# EAGLE design LoadTag (EAGLE 5.11)
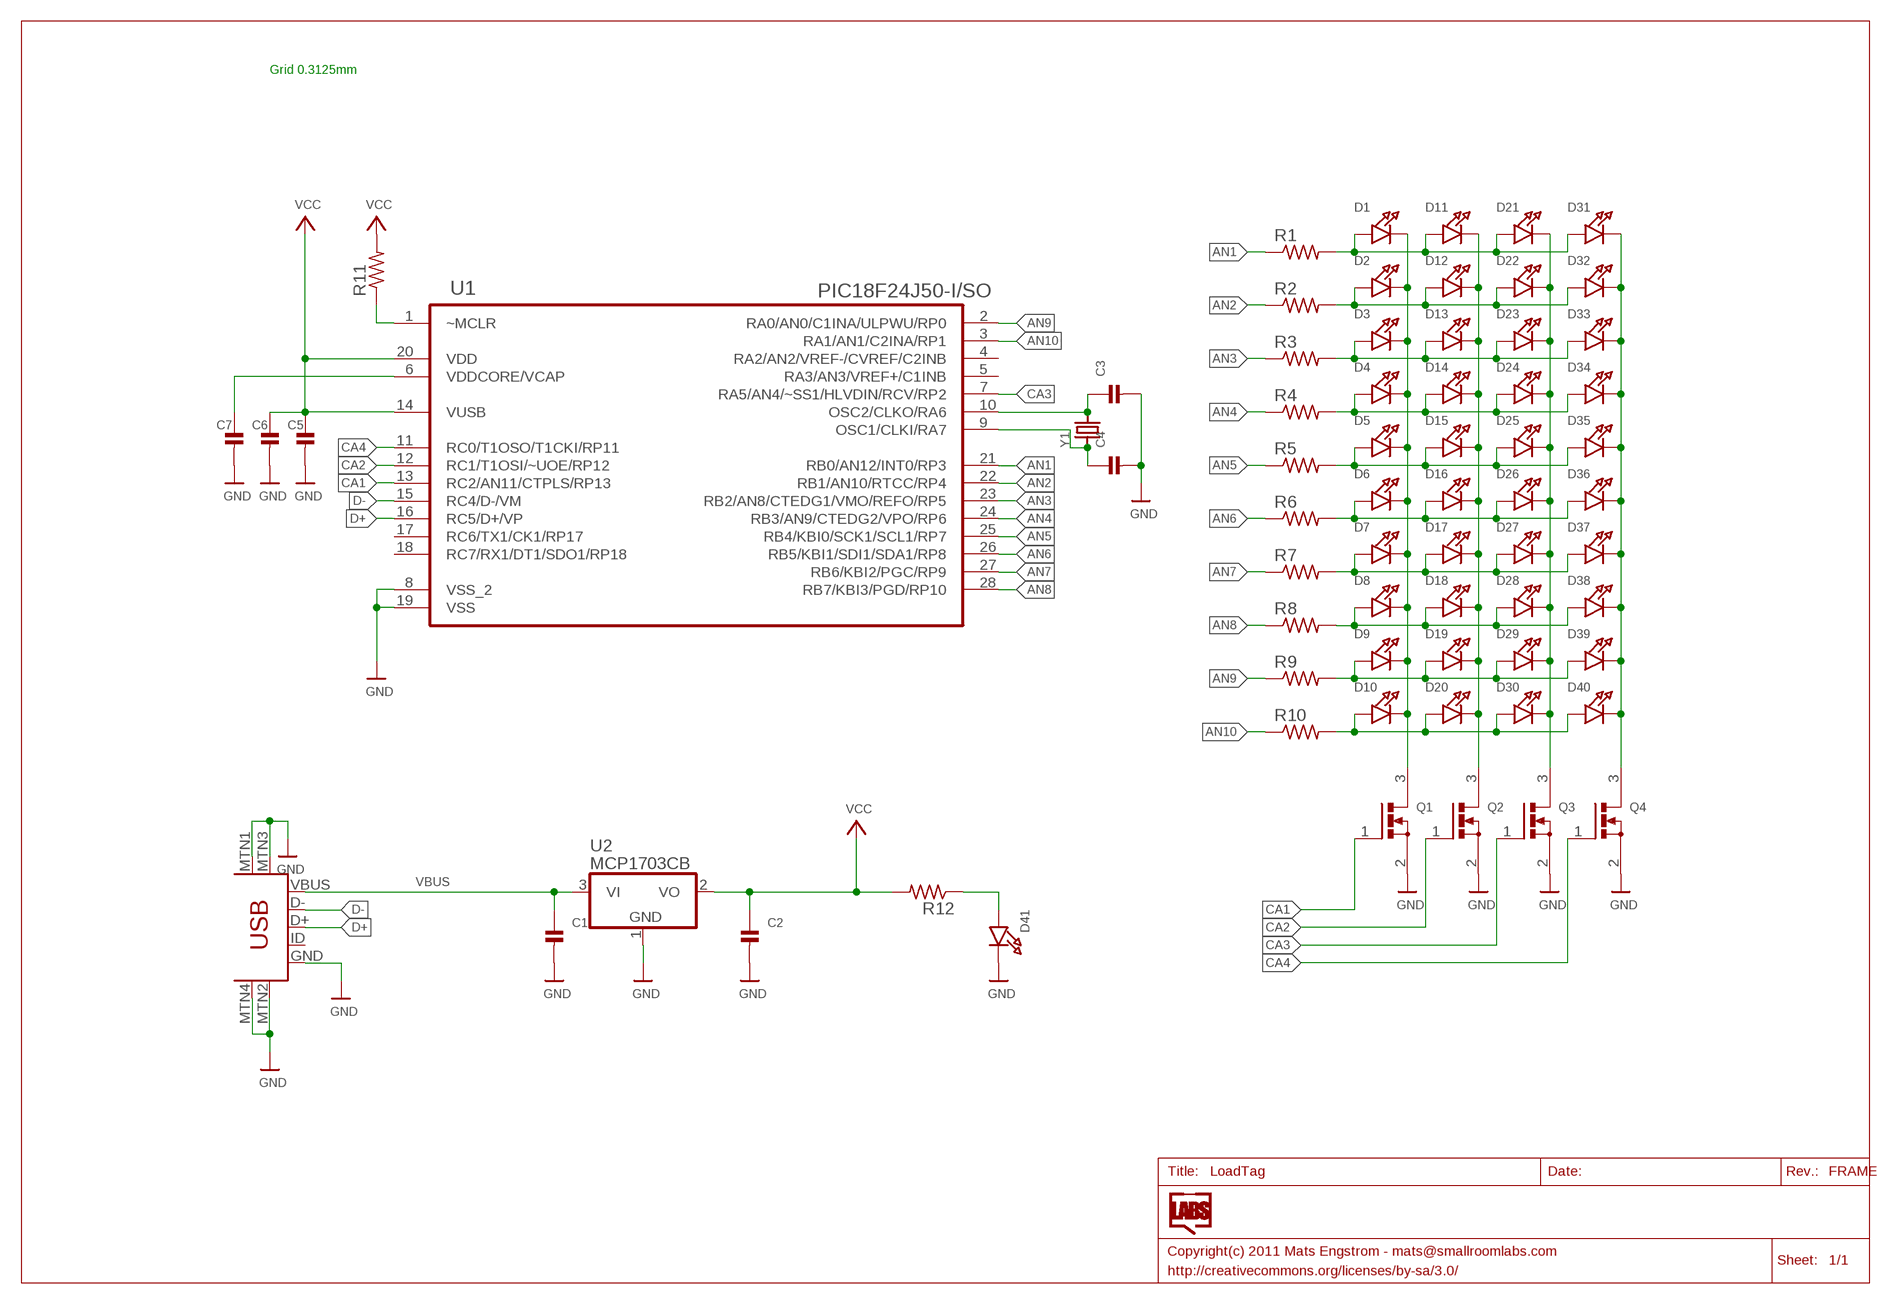
[diagram p0: schematic, sheet 1]

## Parts
C1  CAP_CERAMIC0805  [0805]
C2  CAP_CERAMIC0805  [0805]
C3  CAP_CERAMIC0805  [0805]
C4  CAP_CERAMIC0805  [0805]
C5  CAP_CERAMIC0805  [0805]
C6  CAP_CERAMIC0805  [0805]
C7  CAP_CERAMIC0805  [0805]
CN1  USB-MINIB-5PIN  [USB-MINIB]
D1  LEDSMD0805  [CHIPLED_0805]
D2  LEDSMD0805  [CHIPLED_0805]
D3  LEDSMD0805  [CHIPLED_0805]
D4  LEDSMD0805  [CHIPLED_0805]
D5  LEDSMD0805  [CHIPLED_0805]
D6  LEDSMD0805  [CHIPLED_0805]
D7  LEDSMD0805  [CHIPLED_0805]
D8  LEDSMD0805  [CHIPLED_0805]
D9  LEDSMD0805  [CHIPLED_0805]
D10  LEDSMD0805  [CHIPLED_0805]
D11  LEDSMD0805  [CHIPLED_0805]
D12  LEDSMD0805  [CHIPLED_0805]
D13  LEDSMD0805  [CHIPLED_0805]
D14  LEDSMD0805  [CHIPLED_0805]
D15  LEDSMD0805  [CHIPLED_0805]
D16  LEDSMD0805  [CHIPLED_0805]
D17  LEDSMD0805  [CHIPLED_0805]
D18  LEDSMD0805  [CHIPLED_0805]
D19  LEDSMD0805  [CHIPLED_0805]
D20  LEDSMD0805  [CHIPLED_0805]
D21  LEDSMD0805  [CHIPLED_0805]
D22  LEDSMD0805  [CHIPLED_0805]
D23  LEDSMD0805  [CHIPLED_0805]
D24  LEDSMD0805  [CHIPLED_0805]
D25  LEDSMD0805  [CHIPLED_0805]
D26  LEDSMD0805  [CHIPLED_0805]
D27  LEDSMD0805  [CHIPLED_0805]
D28  LEDSMD0805  [CHIPLED_0805]
D29  LEDSMD0805  [CHIPLED_0805]
D30  LEDSMD0805  [CHIPLED_0805]
D31  LEDSMD0805  [CHIPLED_0805]
D32  LEDSMD0805  [CHIPLED_0805]
D33  LEDSMD0805  [CHIPLED_0805]
D34  LEDSMD0805  [CHIPLED_0805]
D35  LEDSMD0805  [CHIPLED_0805]
D36  LEDSMD0805  [CHIPLED_0805]
D37  LEDSMD0805  [CHIPLED_0805]
D38  LEDSMD0805  [CHIPLED_0805]
D39  LEDSMD0805  [CHIPLED_0805]
D40  LEDSMD0805  [CHIPLED_0805]
D41  LEDSMD0805  [CHIPLED_0805]
Q1  MOSFET-NREFLOW  [SOT23-R]
Q2  MOSFET-NREFLOW  [SOT23-R]
Q3  MOSFET-NREFLOW  [SOT23-R]
Q4  MOSFET-NREFLOW  [SOT23-R]
R1  RES0805A  [R0805A]
R2  RES0805A  [R0805A]
R3  RES0805A  [R0805A]
R4  RES0805A  [R0805A]
R5  RES0805A  [R0805A]
R6  RES0805A  [R0805A]
R7  RES0805A  [R0805A]
R8  RES0805A  [R0805A]
R9  RES0805A  [R0805A]
R10  RES0805A  [R0805A]
R11  RES0805A  [R0805A]
R12  RES0805A  [R0805A]
U1  PIC18F24J50-I/SO  [SOIC127P1030X265-28N]
U2  MCP1703CB  [SOT23]
Y1  CRYSTALSMD  [HC49UP]

## Nets
AN1: R1.1 U1.21(RB0/AN12/INT0/RP3)
AN2: R2.1 U1.22(RB1/AN10/RTCC/RP4)
AN3: R3.1 U1.23(RB2/AN8/CTEDG1/VMO/REFO/RP5)
AN4: R4.1 U1.24(RB3/AN9/CTEDG2/VPO/RP6)
AN5: R5.1 U1.25(RB4/KBI0/SCK1/SCL1/RP7)
AN6: R6.1 U1.26(RB5/KBI1/SDI1/SDA1/RP8)
AN7: R7.1 U1.27(RB6/KBI2/PGC/RP9)
AN8: R8.1 U1.28(RB7/KBI3/PGD/RP10)
AN9: R9.1 U1.2(RA0/AN0/C1INA/ULPWU/RP0)
AN10: R10.1 U1.3(RA1/AN1/C2INA/RP1)
CA1: Q1.1(G) U1.13(RC2/AN11/CTPLS/RP13)
CA2: Q2.1(G) U1.12(RC1/T1OSI/~UOE/RP12)
CA3: Q3.1(G) U1.7(RA5/AN4/~SS1/HLVDIN/RCV/RP2)
CA4: Q4.1(G) U1.11(RC0/T1OSO/T1CKI/RP11)
D+: CN1.D+ U1.16(RC5/D+/VP)
D-: CN1.D- U1.15(RC4/D-/VM)
GND: C1.2 C2.2 C3.2 C4.2 C5.2 C6.2 C7.2 CN1.GND CN1.MTN1(MTN2) CN1.MTN2(MTN3) CN1.MTN3(MTN1) CN1.MTN4 D41.C Q1.2(S) Q2.2(S) Q3.2(S) Q4.2(S) U1.8(VSS_2) U1.19(VSS) U2.1(GND)
N$1: D1.A D11.A D21.A D31.A R1.2
N$2: D2.A D12.A D22.A D32.A R2.2
N$3: D3.A D13.A D23.A D33.A R3.2
N$4: D4.A D14.A D24.A D34.A R4.2
N$5: D5.A D15.A D25.A D35.A R5.2
N$6: D6.A D16.A D26.A D36.A R6.2
N$7: D7.A D17.A D27.A D37.A R7.2
N$8: D8.A D18.A D28.A D38.A R8.2
N$9: D9.A D19.A D29.A D39.A R9.2
N$10: D10.A D20.A D30.A D40.A R10.2
N$11: D1.C D2.C D3.C D4.C D5.C D6.C D7.C D8.C D9.C D10.C Q1.3(D)
N$12: D11.C D12.C D13.C D14.C D15.C D16.C D17.C D18.C D19.C D20.C Q2.3(D)
N$13: D21.C D22.C D23.C D24.C D25.C D26.C D27.C D28.C D29.C D30.C Q3.3(D)
N$14: D31.C D32.C D33.C D34.C D35.C D36.C D37.C D38.C D39.C D40.C Q4.3(D)
N$15: D41.A R12.1
N$16: C7.1 U1.6(VDDCORE/VCAP)
N$17: R11.1 U1.1(~MCLR)
OSC1: C4.1 U1.9(OSC1/CLKI/RA7) Y1.1
OSC2: C3.1 U1.10(OSC2/CLKO/RA6) Y1.2
VBUS: C1.1 CN1.VBUS U2.3(VI)
VCC: C2.1 C5.1 C6.1 R11.2 R12.2 U1.14(VUSB) U1.20(VDD) U2.2(VO)
Unconnected: CN1.ID U1.4(RA2/AN2/VREF-/CVREF/C2INB) U1.5(RA3/AN3/VREF+/C1INB) U1.17(RC6/TX1/CK1/RP17) U1.18(RC7/RX1/DT1/SDO1/RP18)

## Notes on the sheet
- Grid 0.3125mm

## Library data of the parts
C1-C7 = microbuilder:CAP_CERAMIC: Ceramic Capacitors 0402 - 0402 Surface Mount Capacitors 0.1uF 10V 10% [Digikey: 490-1318-2-ND] 0603 - 0603 Surface Mount Capacitors 16 pF 50V 5% [Digikey: 445-5051-2-ND] 22 pF 50V [Digikey: PCC220ACVTR-ND] 33 pF 50V 5% [Digikey: 490-1415-1-ND] 56pF 50V 5% [Digikey: 490-1421-1-ND] 220pF 50V 5% [Digikey: 445-1285-1-ND] 680 pF 50V 2200 pF 50V 5% C0G [Digikey: 445-1297-1-ND] 5600 pF 100V 5% X7R [Digikey: 478-3711-1-ND] 0.1 µF 25V 10% [Digikey: PCC2277TR-ND] 0.22 µF 16V 10% X7R [Digikey: 445-1318-1-ND] 1.0 µF 25V 10% [Digikey: 445-5146-2-ND] 0603 - RF Specific 3pF 250V +/-0.1pF RF [Digikey: 712-1347-1-ND] 18 pF 250V 5% [Digikey: 478-3505-1-ND or 712-1322-1-ND] 56 pF 250V 5% C0G RF [Digikey: 490-4867-1-ND] 68 pF 250V RF [Digikey: 490-4868-1-ND] 0805 - 0805 Surface Mount Capacitors 220 pF 250V 2% RF Ceramic Capacitor [Digikey: 712-1398-1-ND] 1000 pF 50V 2% NP0 Ceramic Capacitor [Digikey: 478-3760-1-ND] 0.1 µF 25V 10% Ceramic Capacitor [Digikey: PCC1828TR-ND] 1.0 µF 16V 10% Ceramic Capacitor[Digikey: 490-1691-2-ND] 10.0 µF 10V 10% Ceramic Capacitor[Digikey: 709-1228-1-ND] 1206 - 1206 Surface Mount Capacitors
CN1 = SparkFun:USB-MINIB: Mini-USB "B" connector with 5th pin broken out. Created new symbol breaking out 5th "ID" pin in mini/micro USB connector spec. See: http://en.wikipedia.org/wiki/Mini_usb#Cables. Uses same footprint as 4-pin symbol. Also added pins to connect to mounting / shield pads if required (probably not generally needed as signals aren't shielded once they leave the connector).
D1-D41 = SmallRoomLabs:LED
Q1-Q4 = microbuilder:MOSFET-N: N-Channel Mosfet Digikey: 2N7002ET1GOSTR-ND
R1-R12 = SmallRoomLabs:RES
U1 = SmallRoomLabs:PIC18F24J50-I/SO: High-Performance Enhanced Flash Microcontrollers; MPN: PIC18F24J50-I/SO; OC_FARNELL: 1778466; OC_NEWARK: 98M1772; PACKAGE: SOIC-28; SUPPLIER: Microchip
U2 = linear:MCP1703: 250 mA, 16V, Low Quiescent Current LDO Regulator Source: http://ww1.microchip.com/downloads/en/DeviceDoc/22049b.pdf
Y1 = microbuilder:CRYSTAL: Crystals HC49UP - Surface Mount Crystal 4.0MHz 18pF +/-30ppm Surface Mount Crystal [Digikey: 535-9857-1-ND] 12.0 MHz Surface Mount Crystal [Digikey: 535-9869-6-ND] 25.0 MHz Surface Mount Crystal [Digikey: 535-9078-1-ND] 3.2 x 2.5mm - MEMs SMT Crystal 12.0 MHz 8pF 15ppm 3.2 x 2.5mm Crystal [Digikey: 644-1047-1-ND] 16.0 MHz 8pF 15ppm 3.2 x 2.5mm Crystal [Digikey: 644-1049-1-ND] 16.0 MHz 10pF 10ppm 3.2 x 2.5mm Crystal [Digikey: 644-1100-1-ND] 27.12 MHz 18pF 30ppm 3.2 x 2.5mm Crystal [Digikey: 887-1424-1-ND] 4.9 x 1.8mm - MEMs SMT Crystal 32.768 KHz 12.5pF 20ppm 4.9 x 1.8mm Crystal [Digikey: SE2415CT-ND] Cylinder 32.768KHz Cylinder Crystal

## Net classes
0 default: width 0.203 mm, drill 0.305 mm, clearance 0.203 mm

## Board
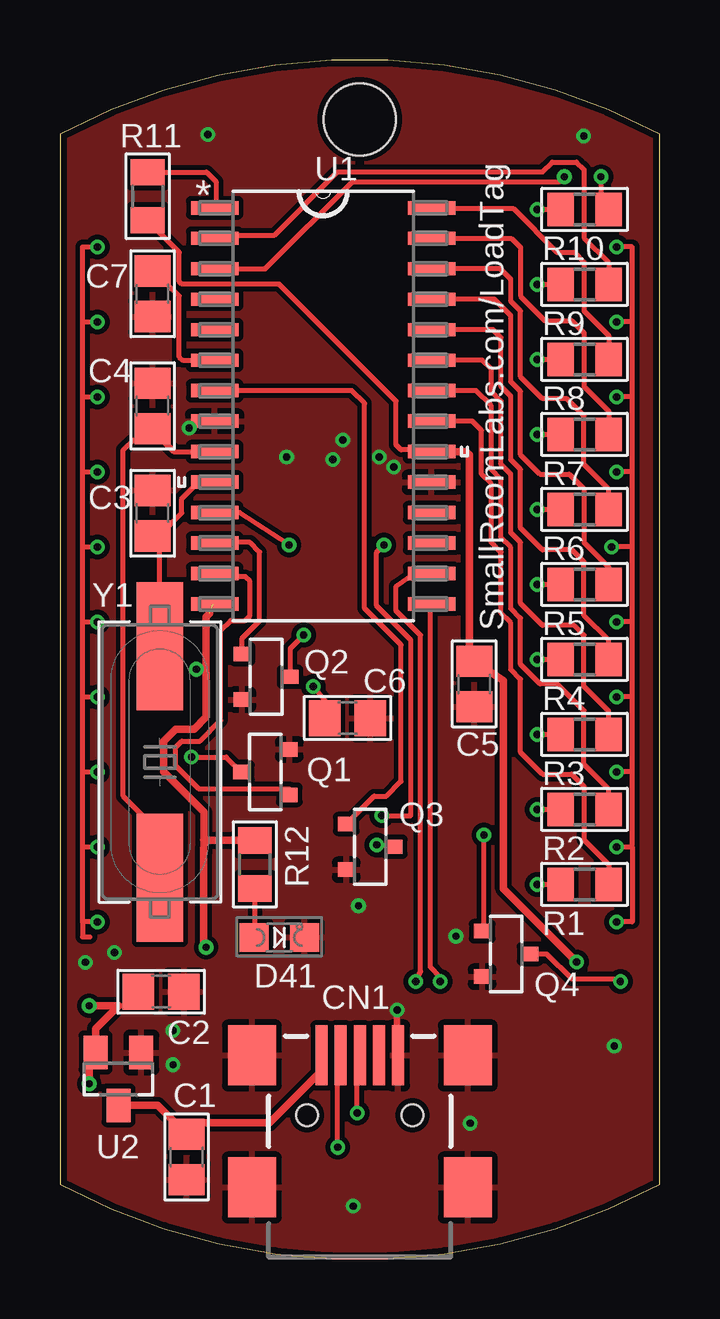
[diagram p1: board, top side]
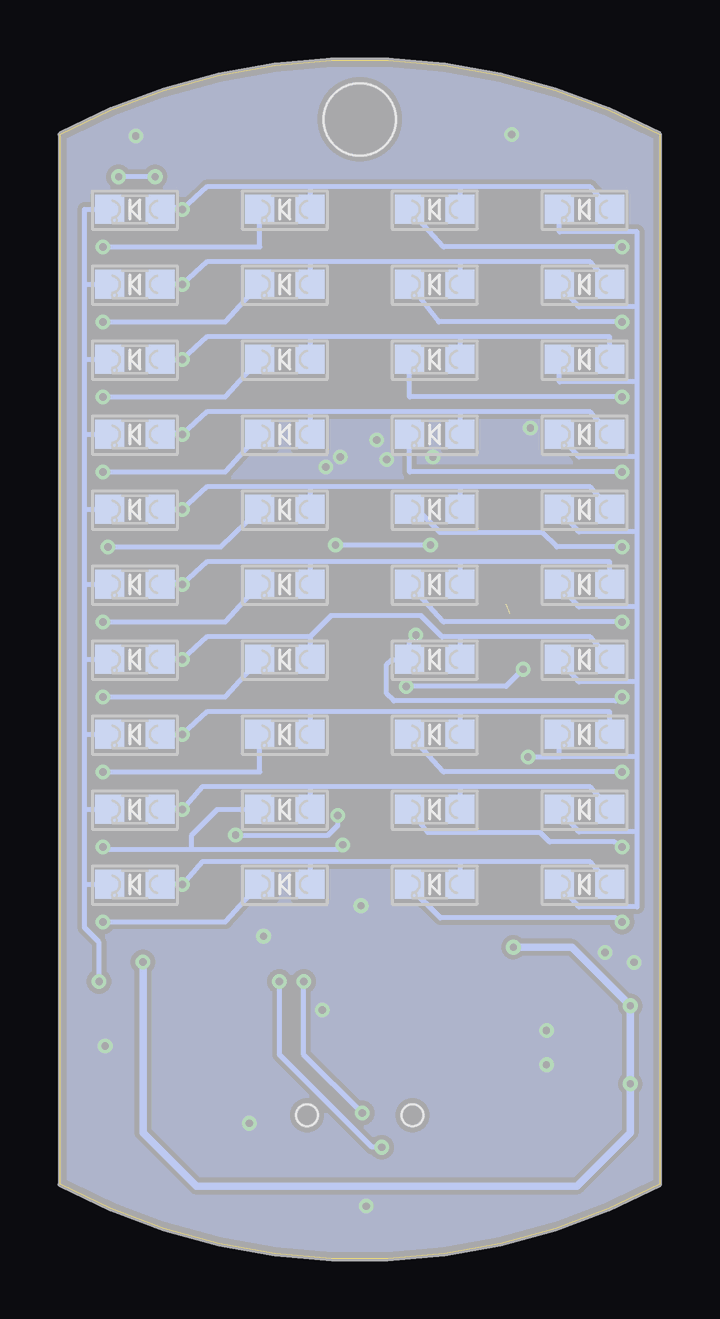
[diagram p2: board, bottom side, seen from below]

Size 25 x 49.95 mm. Coordinates in mm from the lower left corner, seen from the top.
Outline: 0,3.1 arc56 25,3.1 25,46.85 arc56 0,46.85 0,3.1
Copper layers (1*16): Top 0.035mm / dielectric 1.5mm / Bottom 0.035mm
Design rules "Fusion_eagle_rule_v1.1": minimum track width 6mil, minimum drill 12mil, track to track 6mil, track to pad 6mil, pad to pad 6mil, via to via 6mil, smd to smd 0mil, copper to edge 10mil, drill to drill 10mil, minimum pad ring 10mil, minimum via ring 6mil, stop-mask expansion 2mil, vias tented up to drill 100mil, thermal gap 10mil
Holes 3 mm at 12.5,47.47

### Footprints (pad centres in the part's own frame; a part is rotated, then mirrored left to right if it is on the bottom)
0805 = smd 1.3 x 1.5: 1 -0.95,0; 2 0.95,0
USB-MINIB = smd 2.5 x 0.5: D+ 2.5,0; D- 2.5,0.8; GND 2.5,-1.6; ID 2.5,-0.8; VBUS 2.5,1.6 | smd 2.5 x 2: MTN1 -3,4.5; MTN2 2.5,4.5; MTN3 -3,-4.5; MTN4 2.5,-4.5 | hole 0.9: 0,2.2; 0,-2.2
CHIPLED_0805 = smd 1.2 x 1.2: A 0,-1.05; C 0,1.05
SOT23-R = smd 0.6 x 0.7: 1 -0.95,-1; 2 0.95,-1; 3 0,1
R0805A = smd 1.1 x 1.4: 1 -1,0; 2 1,0
SOIC127P1030X265-28N = smd 1.981 x 0.559: 1 -4.521,8.255; 2 -4.521,6.985; 3 -4.521,5.715; 4 -4.521,4.445; 5 -4.521,3.175; 6 -4.521,1.905; 7 -4.521,0.635; 8 -4.521,-0.635; 9 -4.521,-1.905; 10 -4.521,-3.175; 11 -4.521,-4.445; 12 -4.521,-5.715; 13 -4.521,-6.985; 14 -4.521,-8.255; 15 4.521,-8.255; 16 4.521,-6.985; 17 4.521,-5.715; 18 4.521,-4.445; 19 4.521,-3.175; 20 4.521,-1.905; 21 4.521,-0.635; 22 4.521,0.635; 23 4.521,1.905; 24 4.521,3.175; 25 4.521,4.445; 26 4.521,5.715; 27 4.521,6.985; 28 4.521,8.255
SOT23 = smd 1 x 1.4: 1 -0.95,-1.1; 2 0.95,-1.1; 3 0,1.1
HC49UP = smd 5.334 x 1.93: 1 -4.826,0; 2 4.826,0

### Placement (x,y rotation side)
C1  5.28,4.24 270 top
C2  4.22,11.13 0 top
C3  3.86,31.06 90 top
C4  3.86,35.53 90 top
C5  17.27,23.95 270 top
C6  11.99,22.53 0 top
C7  3.86,40.21 270 top
CN1  12.5,5.97 90 top
D1  3.12,15.6 90 bottom
D2  3.12,18.72 90 bottom
D3  3.12,21.85 90 bottom
D4  3.12,24.97 90 bottom
D5  3.12,28.1 90 bottom
D6  3.12,31.22 90 bottom
D7  3.12,34.35 90 bottom
D8  3.12,37.47 90 bottom
D9  3.12,40.6 90 bottom
D10  3.12,43.72 90 bottom
D11  9.38,15.6 90 bottom
D12  9.38,18.72 90 bottom
D13  9.38,21.85 90 bottom
D14  9.38,24.97 90 bottom
D15  9.38,28.1 90 bottom
D16  9.38,31.22 90 bottom
D17  9.38,34.35 90 bottom
D18  9.38,37.47 90 bottom
D19  9.38,40.6 90 bottom
D20  9.38,43.72 90 bottom
D21  15.62,15.6 90 bottom
D22  15.62,18.72 90 bottom
D23  15.62,21.85 90 bottom
D24  15.62,24.97 90 bottom
D25  15.62,28.1 90 bottom
D26  15.62,31.22 90 bottom
D27  15.62,34.35 90 bottom
D28  15.62,37.47 90 bottom
D29  15.62,40.6 90 bottom
D30  15.62,43.72 90 bottom
D31  21.88,15.6 90 bottom
D32  21.88,18.72 90 bottom
D33  21.88,21.85 90 bottom
D34  21.88,24.97 90 bottom
D35  21.88,28.1 90 bottom
D36  21.88,31.22 90 bottom
D37  21.88,34.35 90 bottom
D38  21.88,37.47 90 bottom
D39  21.88,40.6 90 bottom
D40  21.88,43.72 90 bottom
D41  9.14,13.38 270 top
Q1  8.57,20.28 90 top
Q2  8.6,24.25 270 top
Q3  12.94,17.17 270 top
Q4  18.61,12.7 270 top
R1  21.88,15.6 180 top
R2  21.88,18.72 180 top
R3  21.88,21.85 180 top
R4  21.88,24.97 180 top
R5  21.88,28.1 180 top
R6  21.88,31.22 180 top
R7  21.88,34.35 180 top
R8  21.88,37.47 180 top
R9  21.88,40.6 180 top
R10  21.88,43.72 180 top
R11  3.66,44.27 270 top
R12  8.13,16.43 90 top
U1  10.97,35.53 0 top
U2  2.44,7.49 180 top
Y1  4.17,20.7 90 top

### Tracks (layer width: path | path; a pad name or v marks a point on that pad's centre or on a via)
AN1
  Top 0.203: R1.1 22.88,16.42 21.84,17.45 21.84,19.68 21.34,20.19 20.12,20.19 19.2,21.11 19.2,24.15 18.8,24.56 18.8,26.49 18.39,26.9 18.39,29.44 17.98,29.84 17.98,32.28 17.58,32.69 17.58,34.52 17.2,34.9 U1.21
AN2
  Top 0.203: R2.1 22.88,19.57 21.84,20.6 21.84,22.83 20.73,23.95 20.02,23.95 19.2,24.76 19.2,26.69 18.8,27.1 18.8,29.64 18.39,30.05 18.39,32.49 17.98,32.89 17.98,35.53 17.35,36.17 U1.22
AN3
  Top 0.203: R3.1 22.88,22.82 21.84,23.85 21.84,25.98 21.44,26.39 20.12,26.39 19.2,27.3 19.2,29.84 18.8,30.25 18.8,32.69 18.39,33.1 18.39,35.74 17.98,36.14 17.98,37.06 17.6,37.44 U1.23
AN4
  Top 0.203: R4.1 22.88,25.76 21.84,26.8 21.84,29.03 21.34,29.54 20.12,29.54 19.2,30.45 19.2,32.89 18.8,33.3 18.8,35.94 18.39,36.35 18.39,38.38 18.06,38.71 U1.24
AN5
  Top 0.203: R5.1 22.88,28.81 21.84,29.84 21.84,32.08 21.23,32.69 20.02,32.69 19.2,33.5 19.2,36.14 18.8,36.55 18.8,39.29 18.11,39.98 U1.25
AN6
  Top 0.203: R6.1 22.88,32.06 21.84,33.1 21.84,35.13 21.13,35.84 20.12,35.84 19.2,36.75 19.2,39.5 18.8,39.9 18.8,40.82 18.36,41.25 U1.26
AN7
  Top 0.203: R7.1 22.88,35.32 21.84,36.35 21.84,38.58 21.34,39.09 20.22,39.09 19.2,40.11 19.2,42.14 18.82,42.52 U1.27
AN8
  Top 0.203: U1.28 14.81,43.66 | 14.76,43.86 U1.28 | R8.1 22.88,38.46 21.84,39.5 21.84,41.53 21.44,41.93 20.73,41.93 18.9,43.76 15.52,43.76 U1.28
AN9
  Top 0.203: R9.1 22.88,41.51 21.84,42.54 21.84,45.39 21.54,45.69 20.52,45.69 20.12,45.29 11.58,45.29 8.94,42.65 5.77,42.65 U1.2
AN10  (via drill 0.3)
  Top 0.203: 22.7,43.72 R10.1 22.55,44.01 v22.55,45.08 | 5.61,41.22 U1.3 8.56,41.25 12.19,44.88 20.83,44.88 v21.03,45.08
  Bottom 0.203: v21.03,45.08 v22.55,45.08
CA1
  Top 0.203: U1.13 6.58,28.42 7.72,28.42 7.92,28.22 7.92,26.8 7.72,26.59 7.11,26.59 6.71,26.19 6.71,22.43 5.84,21.56 5.08,21.56 4.83,21.31 4.83,20.55 5.79,19.58 9.56,19.58 Q1.1
CA2
  Top 0.203: Q2.1 7.6,25.86 8.33,26.59 8.33,29.44 7.92,29.84 6.48,29.84 U1.12
CA3
  Top 0.203: U1.7 12.17,36.17 12.7,35.64 12.7,27.1 14.22,25.58 14.22,19.89 13.61,19.28 13.1,19.28 Q3.1
CA4  (via drill 0.3)
  Top 0.203: U1.11 7.49,31.09 v9.55,29.74 | v13.41,18.46 14.63,18.46 14.63,25.78 13.21,27.2 13.21,29.44 v13.51,29.74 | Q4.1 17.68,13.73 v17.68,17.65
  Bottom 0.203: v13.51,29.74 v9.55,29.74 | v13.41,18.46 13.41,18.06 13.82,17.65 v17.68,17.65
D+  (via drill 0.3)
  Top 0.203: U1.16 14.76,28.55 14.02,28.02 14.02,27 15.04,25.98 15.04,11.96 v14.83,11.56 | v12.39,6.07 12.39,7.76 CN1.D+
  Bottom 0.203: v14.83,11.56 14.83,8.51 v12.39,6.07
D-  (via drill 0.3)
  Top 0.203: 15.44,27.2 15.57,27.28 U1.15 15.44,27.23 15.44,12.17 15.85,11.76 v15.85,11.56 | v11.58,4.65 11.58,7.74 CN1.D-
  Bottom 0.203: v15.85,11.56 15.85,8.51 11.99,4.65 v11.58,4.65
GND  (via drill 0.3)
  Top 0.203: 14.05,10.11 v14.06,10.37
  Top 0.254: CN1.GND 14.05,10.11
  other vias: 4.72,9.5 4.72,8.08 9.45,33.4 5.38,34.62 13.92,32.99 11.38,33.3 11.79,34.11 13.31,33.4 17.11,5.64 1.06,12.35 2.28,12.76 12.23,2.19 21.84,46.78 6.16,46.84 16.51,13.44 23.11,8.86 12.45,14.71
  pour Bottom: 0,3.1 arc56 25,3.1 25,46.85 arc56 0,46.85
  pour Top: 0,3.1 arc56 25,3.1 25,46.85 arc56 0,46.85
N$1  (via drill 0.3)
  Top 0.203: v19.89,15.6 R1.2
  Bottom 0.203: 8.32,16.54 2.89,16.54 D1.A | 14.57,16.54 19.08,16.54 v19.89,15.6 19.81,15.59 20.7,15.59 D31.A | 14.57,16.54 D21.A | 8.32,16.54 D11.A | 8.32,16.54 14.57,16.54
N$2  (via drill 0.3)
  Top 0.203: v19.89,18.72 R2.2
  Bottom 0.203: 8.32,19.66 2.89,19.66 D2.A | 8.32,19.66 D12.A | 8.32,19.66 14.57,19.66 | 14.57,19.66 D22.A | 14.57,19.66 19.08,19.66 v19.89,18.72 19.81,18.77 20.7,18.77 D32.A
N$3  (via drill 0.3)
  Top 0.203: v19.89,21.85 R3.2
  Bottom 0.203: 8.32,22.79 2.08,22.79 D3.A | 14.57,22.79 18.88,22.79 v19.89,21.85 19.81,21.82 20.7,21.82 D33.A | 8.32,22.79 D13.A | 14.57,22.79 D23.A | 8.32,22.79 14.57,22.79
N$4  (via drill 0.3)
  Top 0.203: v19.89,24.97 R4.2
  Bottom 0.203: 8.32,25.91 2.89,25.91 D4.A | 14.57,25.91 18.88,25.91 v19.89,24.97 19.81,24.99 20.7,24.99 D34.A | 8.32,25.91 D14.A | 14.57,25.91 D24.A | 8.32,25.91 9.07,25.91 9.96,26.8 13.69,26.8 14.57,25.91
N$5  (via drill 0.3)
  Top 0.203: v19.89,28.1 R5.2
  Bottom 0.203: 8.32,29.04 2.08,29.04 D5.A | 14.57,29.04 18.88,29.04 v19.89,28.1 19.81,28.17 20.7,28.17 D35.A | 8.32,29.04 D15.A | 14.57,29.04 D25.A | 8.32,29.04 14.57,29.04
N$6  (via drill 0.3)
  Top 0.203: v19.89,31.22 R6.2
  Bottom 0.203: 8.32,32.16 2.89,32.16 D6.A | 8.32,32.16 D16.A | 8.32,32.16 14.57,32.16 | 14.57,32.16 D26.A | 14.57,32.16 18.88,32.16 v19.89,31.22 19.81,31.22 20.7,31.22 D36.A
N$7  (via drill 0.3)
  Top 0.203: v19.89,34.35 R7.2
  Bottom 0.203: 8.32,35.29 2.89,35.29 D7.A | 14.57,35.29 18.88,35.29 v19.89,34.35 19.81,34.39 20.7,34.39 D37.A | 14.57,35.29 D27.A | 8.32,35.29 D17.A | 8.32,35.29 14.57,35.29
N$8  (via drill 0.3)
  Top 0.203: v19.89,37.47 R8.2
  Bottom 0.203: 8.32,38.41 2.08,38.41 D8.A | 8.32,38.41 D18.A | 8.32,38.41 14.57,38.41 | 14.57,38.41 D28.A | 14.57,38.41 18.88,38.41 v19.89,37.47 19.81,37.44 20.7,37.44 D38.A
N$9  (via drill 0.3)
  Top 0.203: v19.89,40.6 R9.2
  Bottom 0.203: 8.32,41.54 2.89,41.54 D9.A | 14.57,41.54 18.88,41.54 v19.89,40.6 19.81,40.61 20.7,40.61 D39.A | 14.57,41.54 D29.A | 8.32,41.54 D19.A | 8.32,41.54 14.57,41.54
N$10  (via drill 0.3)
  Top 0.203: v19.89,43.72 R10.2
  Bottom 0.203: 8.32,44.66 2.89,44.66 D10.A | 8.32,44.66 D20.A | 8.32,44.66 14.57,44.66 | 14.57,44.66 D30.A | 14.57,44.66 18.88,44.66 v19.89,43.72 19.81,43.79 20.7,43.79 D40.A
N$11  (via drill 0.3)
  Top 0.203: v5.49,20.9 6.94,20.9 Q1.3
  Bottom 0.203: D10.C 4.17,42.79 0.94,42.79 0.94,39.66 | 0.94,17.79 0.94,14.66 3.36,14.66 D1.C | 0.94,17.79 0.94,20.91 | 0.94,20.91 0.94,24.04 | 0.94,24.04 0.94,27.16 | 0.94,27.16 0.94,30.29 | 0.94,30.29 0.94,33.41 | 0.94,33.41 0.94,36.54 | 0.94,36.54 0.94,39.66 | D9.C 3.36,39.66 0.94,39.66 | D8.C 4.17,36.54 0.94,36.54 | D7.C 3.36,33.41 0.94,33.41 | D6.C 3.36,30.29 0.94,30.29 | D5.C 3.36,27.16 0.94,27.16 | D4.C 3.36,24.04 0.94,24.04 | 4.17,20.91 D3.C | 0.94,20.91 4.17,20.91 | D2.C 3.36,17.79 0.94,17.79 | v5.49,20.9 4.18,20.9 4.17,20.91
  Bottom 0.254: D3.C 4.51,21.51
N$12  (via drill 0.3)
  Top 0.203: v1.56,42.16 0.94,42.16 0.94,39.04 | 0.94,14.04 0.94,13.41 1.25,13.41 | 0.94,14.04 0.94,17.16 | 0.94,17.16 0.94,20.29 | 0.94,20.29 0.94,23.41 | 0.94,23.41 0.94,26.54 | 0.94,26.54 0.94,29.66 | 0.94,29.66 0.94,32.79 | 0.94,32.79 0.94,35.91 | 0.94,35.91 0.94,39.04 | 0.94,39.04 v1.56,39.04 | 0.94,35.91 v1.56,35.91 | 0.94,32.79 v1.56,32.79 | 0.94,29.66 v1.56,29.66 | 0.94,26.54 v1.56,26.54 | 0.94,23.41 v1.56,23.41 | 0.94,20.29 v1.56,20.29 | 0.94,17.16 v1.56,17.16 | v1.56,14.04 0.94,14.04 | Q2.3 9.6,25.42 v10.16,25.98
  Bottom 0.203: D20.C 9,42.16 v1.56,42.16 | D19.C 9.21,39.04 v1.56,39.04 | D18.C 10.43,35.91 v1.56,35.91 | D17.C 10.43,32.79 v1.56,32.79 | v1.56,29.66 4.29,29.66 4.88,30.25 9.14,30.25 10.12,31.22 D16.C | D15.C 9,26.54 v1.56,26.54 | D13.C 9,20.29 v1.56,20.29 | v1.56,17.16 1.89,17.36 4.59,17.36 4.98,17.75 9.66,17.75 D12.C | v1.56,14.04 1.67,14.04 1.83,14.2 9.14,14.2 10.43,15.48 D11.C | v1.56,23.41 1.83,23.24 11.07,23.24 11.38,23.54 11.38,24.76 11.18,24.97 D14.C | D14.C 10.76,24.97 | D14.C 10.43,25.72 v10.16,25.98
N$13  (via drill 0.3)
  Top 0.203: v23.2,42.16 23.86,42.16 23.86,39.04 | 23.86,17.16 23.86,20.29 | 23.86,17.16 23.86,14.04 v23.2,14.04 | 23.86,20.29 23.86,23.41 | 23.86,23.41 23.86,26.54 | 23.86,26.54 23.86,29.66 | 23.86,29.66 23.86,32.79 | 23.86,32.79 23.86,35.91 | 23.86,35.91 23.86,39.04 | 23.86,39.04 v23.2,39.04 | 23.86,35.91 v23.2,35.91 | 23.86,32.79 v23.2,32.79 | 23.86,29.66 v23,29.66 | 23.86,26.54 v23.2,26.54 | 23.86,23.41 v23.2,23.41 | 23.86,20.29 v23.2,20.29 | v23.2,17.16 23.86,17.16 | Q3.3 13.69,17.17 v13.21,17.25
  Bottom 0.203: D30.C 16.68,42.16 v23.2,42.16 | D29.C 18.1,39.04 v23.2,39.04 | D28.C 18.1,35.91 v23.2,35.91 | D27.C 18.1,32.79 v23.2,32.79 | D26.C 18.3,29.66 v23,29.66 | D25.C 18.1,26.54 v23.2,26.54 | D24.C 18.1,23.41 v23.2,23.41 | D23.C 16.68,20.29 v23.2,20.29 | D21.C 18.1,14.04 v23.2,14.04 | v13.21,17.25 13.41,17.04 19.51,17.04 | 19.51,17.04 23.09,17.04 v23.2,17.16 | D22.C 18.44,18.72 19.51,17.65 19.51,17.04
N$14  (via drill 0.3)
  Top 0.203: Q4.3 20.29,12.7 21.34,11.66 23.27,11.66 v23.37,11.56
  Bottom 0.203: D40.C 23.98,43.72 23.98,40.6 | 23.98,15.6 D31.C | 23.98,15.6 23.98,18.72 | 23.98,18.72 D32.C | 23.98,18.72 23.98,21.85 | 23.98,21.85 D33.C | 23.98,21.85 23.98,24.97 | 23.98,24.97 D34.C | 23.98,24.97 23.98,28.1 | 23.98,28.1 D35.C | 23.98,28.1 23.98,31.22 | 23.98,31.22 D36.C | 23.98,31.22 23.98,34.35 | 23.98,34.35 D37.C | 23.98,34.35 23.98,37.47 | 23.98,37.47 D38.C | 23.98,37.47 23.98,40.6 | 23.98,40.6 D39.C | 23.98,15.6 23.98,13.79 23.37,13.18 v23.37,11.56
N$15
  Top 0.203: R12.1 8.13,13.62 D41.A
N$16
  Top 0.203: U1.6 5.11,37.44 4.98,37.57 4.98,40.11 C7.1
N$17
  Top 0.203: R11.1 6.11,45.27 6.5,44.88 6.5,43.84 U1.1
OSC1
  Top 0.203: 4.8,33.63 U1.9 | 4.8,33.63 C4.1 | 4.8,33.63 4.75,33.63 4.27,34.11 3.05,34.11 2.64,33.7 2.64,19.28 4.27,17.65 4.27,15.98 Y1.1
OSC2
  Top 0.203: U1.10 6.38,32.28 5.69,32.28 5.08,31.67 5.08,31.06 4.13,30.11 C3.1 4.17,29.81 Y1.2
VBUS
  Top 0.203: 10.85,7.77 CN1.VBUS | C1.1 5.76,5.66
  Top 0.305: 10.85,7.77 8.74,5.66 5.76,5.66 | U2.3 4.08,6.39 C1.1
VCC  (via drill 0.3)  (1 unrouted)
  Top 0.203: R11.2 3.66,43.26 4.98,41.93 4.98,40.72 5.08,40.61 9.14,40.61 14.02,35.74 14.02,33.91 14.22,33.7 15.42,33.7 U1.20 | U1.14 6.38,27.28 | C6.1 11.04,23.28 v10.57,23.85 | 2.44,10.54 2.68,10.54 C2.1
  Top 0.254: 1.22,8.32 U2.2 | 17.07,33.5 16.94,33.63 | C5.1 17.07,25.1
  Top 0.305: v21.54,12.37 18.49,15.42 18.49,24.09 C5.1 | v1.22,7.29 1.22,8.32 | v6.1,12.98 5.99,13.08 5.99,16.94 6.01,17.43 | 16.94,33.63 U1.20 | 17.07,25.1 17.07,33.5 | v1.22,10.54 2.44,10.54 1.49,9.59 U2.2 | 6.01,17.43 R12.2 | 6.01,17.43 5.99,17.45 | 6.25,26.9 6.1,26.75 6.1,24.56 | 6.01,17.43 6.01,18.6 4.32,20.29 4.32,21.56 4.83,22.07 5.59,22.07 6.1,22.58 6.1,24.56 | 6.1,24.56 v5.69,24.56
  Bottom 0.203: v10.57,23.85 6.4,23.85 v5.69,24.56
  Bottom 0.305: v21.54,12.37 21.54,5.26 19.3,3.02 3.45,3.02 1.22,5.26 v1.22,10.54 3.66,12.98 v6.1,12.98

### Text on the board
tPlace: SmallRoomLabs.com/LoadTag